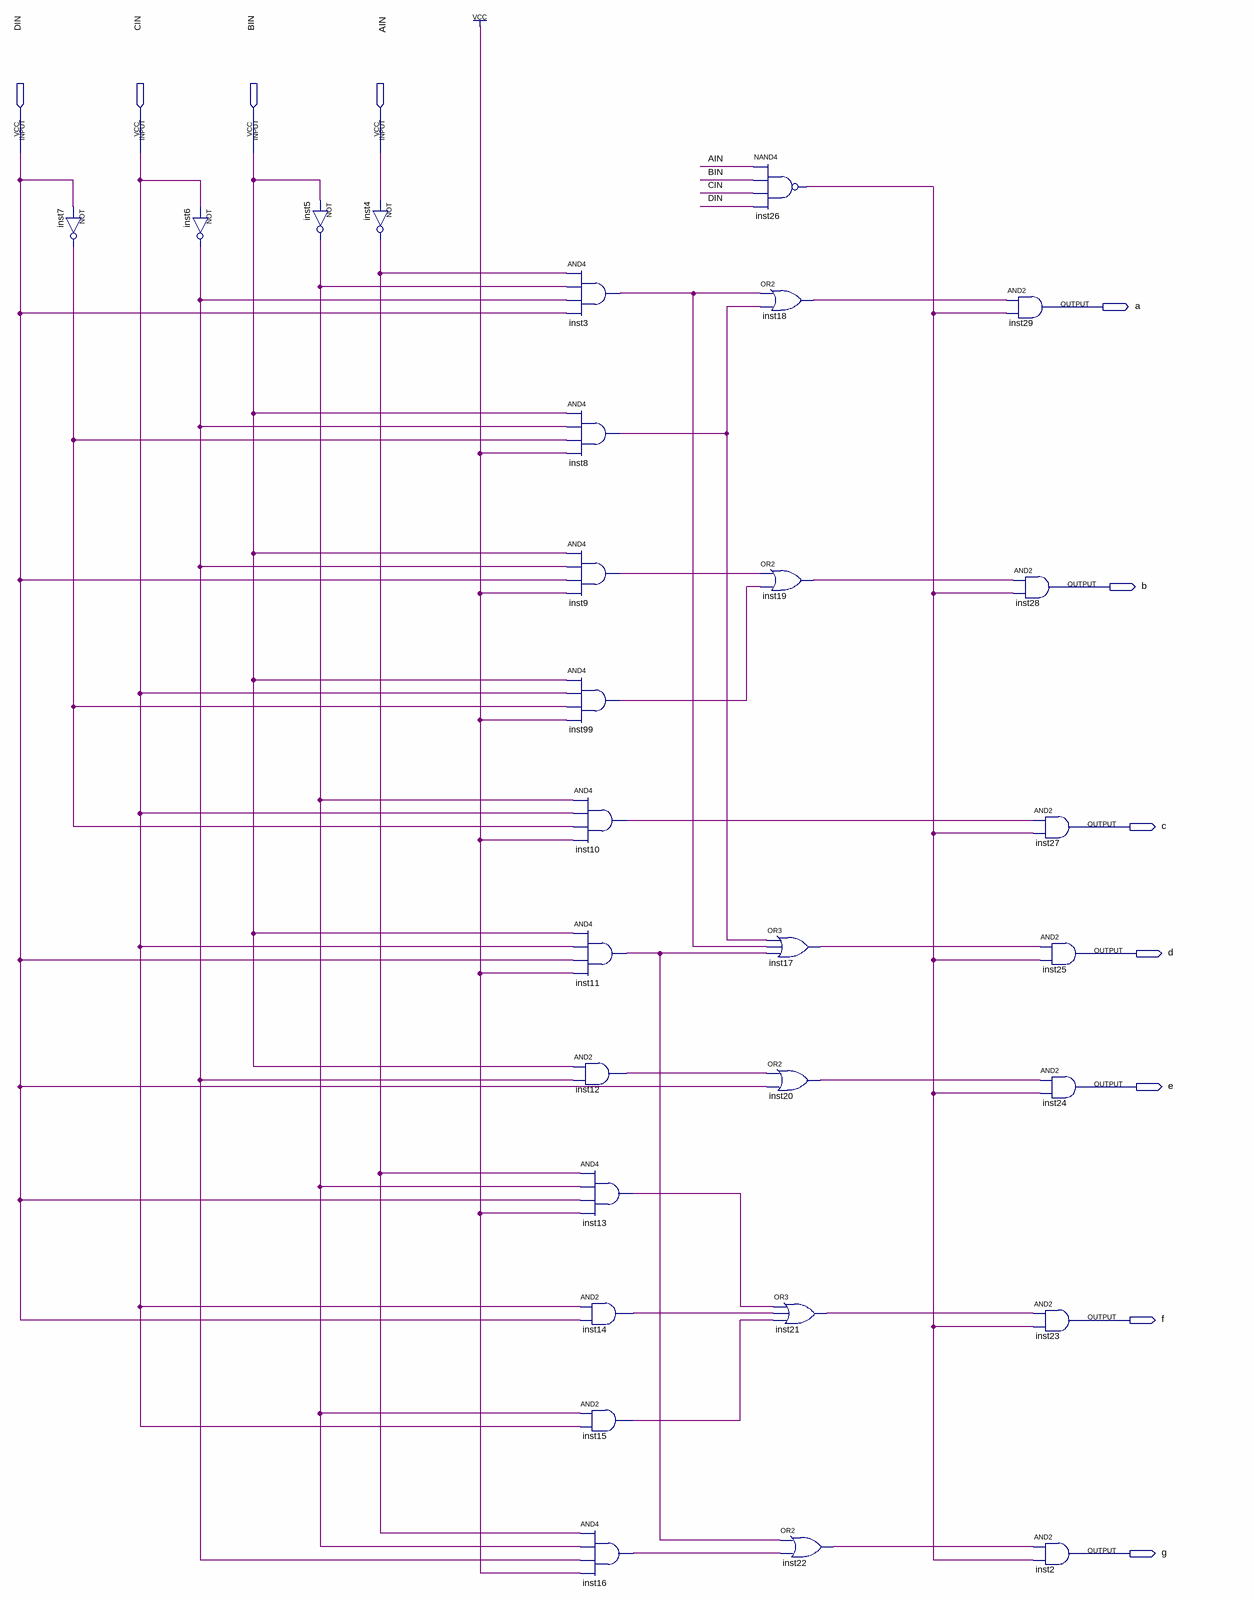
[diagram p0: schematic sheet]
// Quartus schematic BinToSegDecoder.bdf as structural Verilog: 29 symbols, 11 pins
module BinToSegDecoder (
  input  DIN,
  input  CIN,
  input  BIN,
  input  AIN,
  output a,
  output b,
  output c,
  output d,
  output e,
  output f,
  output g
);

  wire inst3_out, inst4_out, inst5_out, inst6_out, inst7_out, inst8_out, inst9_out, inst10_out, inst11_out,
       inst12_out, inst13_out, inst14_out, inst15_out, inst16_out, inst17_out, inst18_out, inst19_out,
       inst20_out, inst21_out, inst22_out, inst26_out, inst99_out;

  not inst7 (inst7_out, DIN);
  not inst6 (inst6_out, CIN);
  not inst5 (inst5_out, BIN);
  not inst4 (inst4_out, AIN);
  and inst3 (inst3_out, inst4_out, inst5_out, inst6_out, DIN);
  and inst8 (inst8_out, BIN, inst6_out, inst7_out, 1'b1);
  and inst9 (inst9_out, BIN, inst6_out, DIN, 1'b1);
  and inst99 (inst99_out, BIN, CIN, inst7_out, 1'b1);
  and inst10 (inst10_out, inst5_out, CIN, inst7_out, 1'b1);
  and inst11 (inst11_out, BIN, CIN, DIN, 1'b1);
  and inst12 (inst12_out, BIN, inst6_out);
  and inst13 (inst13_out, inst4_out, inst5_out, DIN, 1'b1);
  and inst14 (inst14_out, CIN, DIN);
  and inst15 (inst15_out, inst5_out, CIN);
  and inst16 (inst16_out, inst4_out, inst5_out, inst6_out, 1'b1);
  nand inst26 (inst26_out, AIN, BIN, CIN, DIN);
  or inst18 (inst18_out, inst3_out, inst8_out);
  or inst19 (inst19_out, inst9_out, inst99_out);
  or inst17 (inst17_out, inst8_out, inst3_out, inst11_out);
  or inst20 (inst20_out, inst12_out, DIN);
  or inst21 (inst21_out, inst13_out, inst14_out, inst15_out);
  or inst22 (inst22_out, inst11_out, inst16_out);
  and inst29 (a, inst18_out, inst26_out);
  and inst28 (b, inst19_out, inst26_out);
  and inst27 (c, inst10_out, inst26_out);
  and inst25 (d, inst17_out, inst26_out);
  and inst24 (e, inst20_out, inst26_out);
  and inst23 (f, inst21_out, inst26_out);
  and inst2 (g, inst22_out, inst26_out);
endmodule
